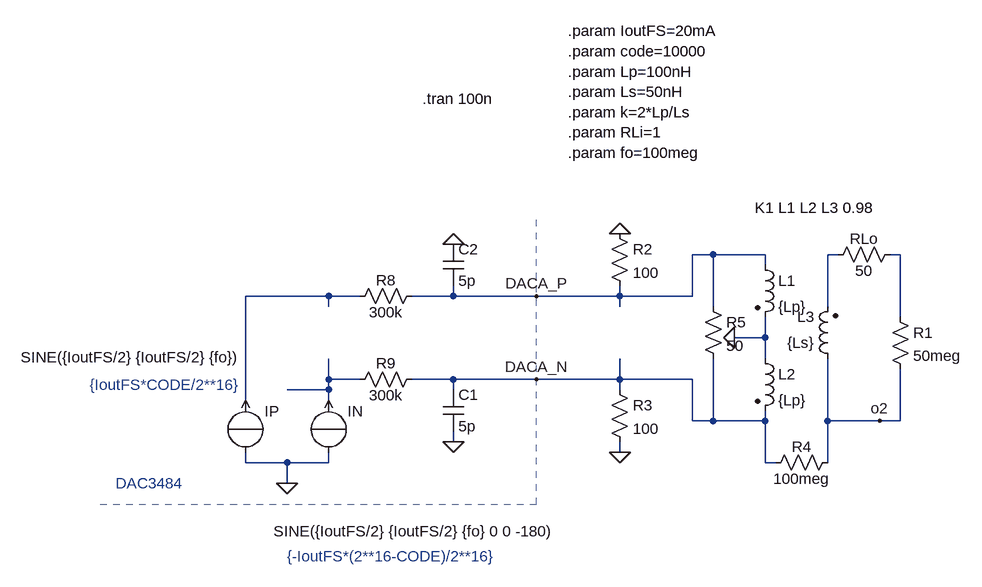
[diagram p0: schematic DAC_differential_current_out.asc]
DAC_differential_current_out.asc, the LTspice schematic file:
Version 4
SHEET 1 880 680
WIRE 192 -224 160 -224
WIRE 272 -224 192 -224
WIRE 384 -224 368 -224
WIRE 480 -224 464 -224
WIRE 272 -208 272 -224
WIRE -400 -160 -528 -160
WIRE -352 -160 -400 -160
WIRE -208 -160 -208 -176
WIRE -208 -160 -272 -160
WIRE -80 -160 -208 -160
WIRE 48 -160 48 -176
WIRE 48 -160 -80 -160
WIRE 160 -160 160 -224
WIRE 160 -160 48 -160
WIRE -400 -144 -400 -160
WIRE 48 -144 48 -160
WIRE 192 -144 192 -224
WIRE 368 -144 368 -224
WIRE 480 -128 480 -224
WIRE 272 -96 272 -128
WIRE 272 -96 224 -96
WIRE 272 -64 272 -96
WIRE -400 -32 -400 -64
WIRE -352 -32 -400 -32
WIRE -208 -32 -272 -32
WIRE -80 -32 -208 -32
WIRE 48 -32 48 -64
WIRE 48 -32 -80 -32
WIRE 160 -32 48 -32
WIRE -400 -16 -400 -32
WIRE -400 -16 -464 -16
WIRE -208 -16 -208 -32
WIRE 48 -16 48 -32
WIRE -528 0 -528 -160
WIRE -400 0 -400 -16
WIRE 160 32 160 -32
WIRE 192 32 192 -64
WIRE 192 32 160 32
WIRE 272 32 272 16
WIRE 272 32 192 32
WIRE 368 32 368 -64
WIRE 448 32 368 32
WIRE 480 32 480 -48
WIRE 480 32 448 32
WIRE -208 64 -208 48
WIRE 48 80 48 64
WIRE -528 96 -528 80
WIRE -464 96 -528 96
WIRE -400 96 -400 80
WIRE -400 96 -464 96
WIRE 272 96 272 32
WIRE 288 96 272 96
WIRE 368 96 368 32
WIRE -464 128 -464 96
FLAG -80 -160 DACA_P
FLAG -80 -32 DACA_N
FLAG -464 128 0
FLAG 48 80 0
FLAG 48 -256 0
FLAG 224 -96 0
FLAG 448 32 o2
FLAG -208 -240 0
FLAG -208 64 0
SYMBOL source-I -528 0 R0
WINDOW 3 -346 -66 Left 0
WINDOW 123 0 0 Left 0
WINDOW 39 0 0 Left 0
SYMATTR Value SINE({IoutFS/2} {IoutFS/2} {fo})
SYMATTR InstName IP
SYMBOL source-I -400 0 R0
WINDOW 123 0 0 Left 0
WINDOW 39 0 0 Left 0
WINDOW 3 -85 202 Left 0
SYMATTR Value SINE({IoutFS/2} {IoutFS/2} {fo} 0 0 -180)
SYMATTR InstName IN
SYMBOL res 32 -32 R0
SYMATTR InstName R3
SYMATTR Value 100
SYMBOL res 32 -272 R0
SYMATTR InstName R2
SYMATTR Value 100
SYMBOL ind2 256 -224 R0
SYMATTR InstName L1
SYMATTR Value {Lp}
SYMATTR Type ind
SYMBOL ind2 256 -80 R0
SYMATTR InstName L2
SYMATTR Value {Lp}
SYMATTR Type ind
SYMBOL ind2 384 -48 R180
WINDOW 0 36 80 Left 0
WINDOW 3 36 40 Left 0
SYMATTR InstName L3
SYMATTR Value {Ls}
SYMATTR Type ind
SYMBOL res 464 -144 R0
SYMATTR InstName R1
SYMATTR Value 50meg
SYMBOL res 384 80 R90
WINDOW 0 7 56 VBottom 0
WINDOW 3 25 56 VTop 0
SYMATTR InstName R4
SYMATTR Value 100meg
SYMBOL res 480 -240 R90
WINDOW 0 7 56 VBottom 0
WINDOW 3 25 56 VTop 0
SYMATTR InstName RLo
SYMATTR Value 50
SYMBOL res -256 -176 R90
WINDOW 0 7 56 VBottom 0
WINDOW 3 25 56 VTop 0
SYMATTR InstName R8
SYMATTR Value 300k
SYMBOL res -256 -48 R90
WINDOW 0 7 56 VBottom 0
WINDOW 3 25 56 VTop 0
SYMATTR InstName R9
SYMATTR Value 300k
SYMBOL cap -224 -16 R0
SYMATTR InstName C1
SYMATTR Value 5p
SYMBOL cap -224 -240 R0
SYMATTR InstName C2
SYMATTR Value 5p
SYMBOL res 176 -160 R0
SYMATTR InstName R5
SYMATTR Value 50
TEXT -728 128 Left 0 ;DAC3484
TEXT -32 -568 Left 0 !.param IoutFS=20mA\n.param code=10000\n.param Lp=100nH\n.param Ls=50nH\n.param k=2*Lp/Ls\n.param RLi=1\n.param fo=100meg
TEXT -256 -464 Left 0 !.tran 100n
TEXT -464 240 Left 0 ;{-IoutFS*(2**16-CODE)/2**16}
TEXT -768 -24 Left 0 ;{IoutFS*CODE/2**16}
TEXT 256 -296 Left 0 !K1 L1 L2 L3 0.98
LINE Normal -80 160 -80 -288 2
LINE Normal -752 160 -80 160 2

The netlist it stands for:
* DAC_differential_current_out.asc
IP 0 N003 SINE({IoutFS/2} {IoutFS/2} {fo})
IN 0 N004 SINE({IoutFS/2} {IoutFS/2} {fo} 0 0 -180)
R3 DACA_N 0 100
R2 0 DACA_P 100
L1 DACA_P 0 {Lp}
L2 0 DACA_N {Lp}
L3 o2 N001 {Ls}
R1 N002 o2 50meg
R4 o2 DACA_N 100meg
RLo N002 N001 50
R8 DACA_P N003 300k
R9 DACA_N N004 300k
C1 DACA_N 0 5p
C2 0 DACA_P 5p
R5 DACA_P DACA_N 50
* DAC3484
.param IoutFS=20mA
.param code=10000
.param Lp=100nH
.param Ls=50nH
.param k=2*Lp/Ls
.param RLi=1
.param fo=100meg
.tran 100n
* {-IoutFS*(2**16-CODE)/2**16}
* {IoutFS*CODE/2**16}
K1 L1 L2 L3 0.98
.backanno
.end